# EAGLE design Switch Board for PC-11491 Joystick Project (EAGLE 9.6.2)
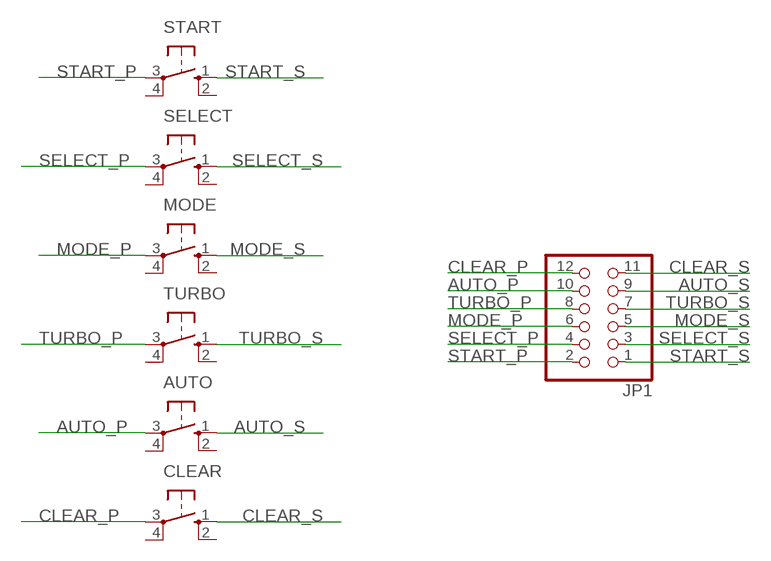
[diagram p0: schematic, sheet 1]

## Parts
AUTO  10-XX  [B3F-10XX]
CLEAR  10-XX  [B3F-10XX]
JP1  PINHD-2X6  [2X06]
MODE  10-XX  [B3F-10XX]
SELECT  10-XX  [B3F-10XX]
START  10-XX  [B3F-10XX]
TURBO  10-XX  [B3F-10XX]

## Nets
AUTO_P: AUTO.3(P) JP1.10
AUTO_S: AUTO.1(S) JP1.9
CLEAR_P: CLEAR.3(P) JP1.12
CLEAR_S: CLEAR.1(S) JP1.11
MODE_P: JP1.6 MODE.3(P)
MODE_S: JP1.5 MODE.1(S)
SELECT_P: JP1.4 SELECT.3(P)
SELECT_S: JP1.3 SELECT.1(S)
START_P: JP1.2 START.3(P)
START_S: JP1.1 START.1(S)
TURBO_P: JP1.8 TURBO.3(P)
TURBO_S: JP1.7 TURBO.1(S)
Unconnected: AUTO.2(S1) AUTO.4(P1) CLEAR.2(S1) CLEAR.4(P1) MODE.2(S1) MODE.4(P1) SELECT.2(S1) SELECT.4(P1) START.2(S1) START.4(P1) TURBO.2(S1) TURBO.4(P1)

## Library data of the parts
AUTO CLEAR MODE SELECT START TURBO = switch-omron:10-XX: OMRON SWITCH; MPN: B3F-1000; OC_FARNELL: 176432; OC_NEWARK: 36M3542
JP1 = pinhead:PINHD-2X6: PIN HEADER

## Board
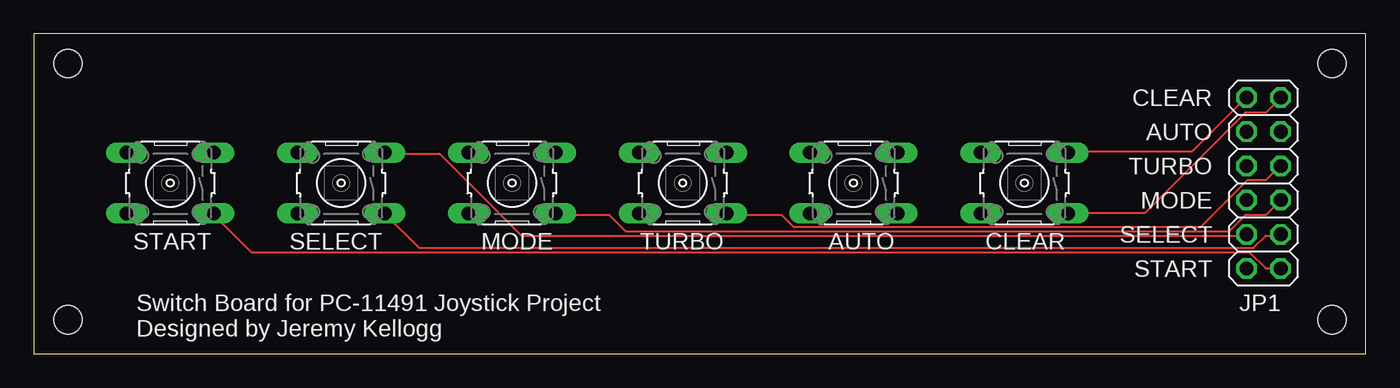
[diagram p1: board, top side]
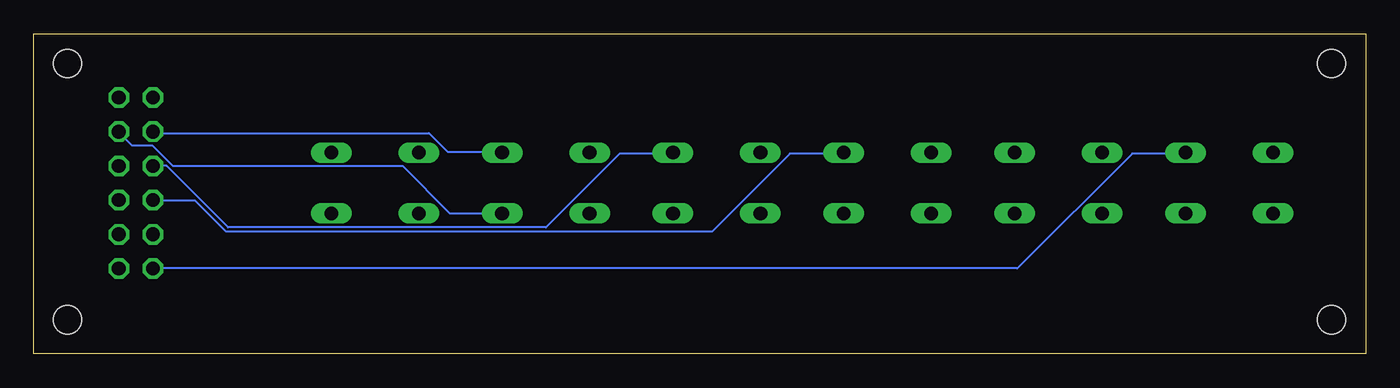
[diagram p2: board, bottom side, seen from below]

Size 99.04 x 23.8 mm. Coordinates in mm from the lower left corner, seen from the top.
Outline: 0,0 99.04,0 99.04,23.8 0,23.8 0,0
Copper layers (1*16): Top 0.035559375mm / dielectric 1.6mm / Bottom 0.035559375mm
Design rules "oshpark-2layer": minimum track width 6mil, minimum drill 10mil, track to track 6mil, track to pad 6mil, pad to pad 6mil, via to via 6mil, smd to smd 6mil, copper to edge 15mil, drill to drill 6mil, minimum pad ring 5mil, minimum via ring 5mil, stop-mask expansion 2.5mil, vias tented up to drill 0mil, thermal gap 10mil
Holes 2.1 mm at 2.54,2.54 2.54,21.59 96.52,21.59 96.52,2.54

### Footprints (pad centres in the part's own frame; a part is rotated, then mirrored left to right if it is on the bottom)
B3F-10XX = drill 1.016 long: 1 -3.251,2.261; 2 3.251,2.261; 3 -3.251,-2.261; 4 3.251,-2.261
2X06 = drill 1.016 octagon: 1 -6.35,-1.27; 2 -6.35,1.27; 3 -3.81,-1.27; 4 -3.81,1.27; 5 -1.27,-1.27; 6 -1.27,1.27; 7 1.27,-1.27; 8 1.27,1.27; 9 3.81,-1.27; 10 3.81,1.27; 11 6.35,-1.27; 12 6.35,1.27

### Placement (x,y rotation side)
AUTO  60.96,12.7 180 top
CLEAR  73.66,12.7 180 top
JP1  91.44,12.7 90 top
MODE  35.56,12.7 180 top
SELECT  22.86,12.7 180 top
START  10.16,12.7 180 top
TURBO  48.26,12.7 180 top

### Tracks (layer width: path | path; a pad name or v marks a point on that pad's centre or on a via)
AUTO_P
  Bottom 0.152: AUTO.3 64.31,15.04 68.28,15.04 69.65,16.41 90.07,16.41 JP1.10
AUTO_S
  Bottom 0.152: AUTO.1 64.31,10.46 68.12,10.46 71.63,13.97 88.7,13.97 90.22,15.49 91.75,15.49 92.66,16.41 JP1.9
CLEAR_P
  Top 0.152: CLEAR.3 76.96,15.04 86.11,15.04 90.07,19 JP1.12
CLEAR_S
  Top 0.152: JP1.11 91.59,17.93 90.07,17.93 82.6,10.46 76.96,10.46 CLEAR.1
MODE_P
  Bottom 0.152: JP1.6 90.07,11.38 87.02,11.38 84.73,9.09 48.62,9.09 42.82,14.88 38.86,14.88 MODE.3
MODE_S
  Top 0.152: JP1.5 91.59,10.31 90.07,10.31 88.85,9.09 44.04,9.09 42.82,10.31 38.86,10.31 MODE.1
SELECT_P
  Top 0.152: JP1.4 90.07,8.79 36.27,8.79 30.18,14.88 26.21,14.88 SELECT.3
SELECT_S
  Top 0.152: JP1.3 92.66,8.79 91.59,8.79 90.68,7.87 28.65,7.87 26.21,10.31 SELECT.1
START_P
  Bottom 0.152: JP1.2 25.91,6.35 17.37,14.88 13.41,14.88 START.3
START_S
  Top 0.152: JP1.1 91.59,6.35 90.37,7.57 16.15,7.57 13.41,10.31 START.1
TURBO_P
  Bottom 0.152: JP1.8 89.15,13.97 84.58,9.4 60.96,9.4 55.47,14.88 51.51,14.88 TURBO.3
TURBO_S
  Top 0.152: TURBO.1 51.51,10.31 55.63,10.31 56.54,9.4 86.72,9.4 90.22,12.9 91.59,12.9 92.66,13.97 JP1.7

### Text on the board
tNames: CLEAR | AUTO | TURBO | MODE | SELECT | START | Switch Board for PC-11491 Joystick Project / Designed by Jeremy Kellogg